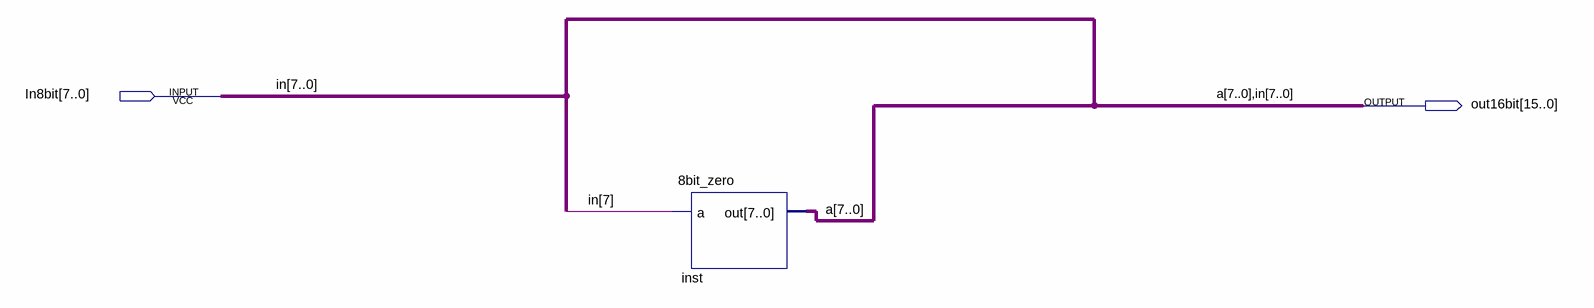
[diagram p0: schematic sheet]
// Quartus schematic 15bitextended.bdf as structural Verilog: 1 symbols, 2 pins
module \15bitextended  (
  input  [7:0] In8bit,
  output [15:0] out16bit
);

  \8bit_zero  inst (.a(In8bit[7]), .out(out16bit[15:8]));

  assign out16bit[7:0] = In8bit;

  // Other names for the same wires on the sheet: a[7:0] = out16bit[15:8]; in[7:0] = In8bit
endmodule
